# EasyEDA Pro project TempControl_PSU.eprj

# Schematic PSU
Create Date: 2024-05-29; Page Name: ILX Lightwave LDT-5910 Replacement PSU; Project Name: TempControl_PSU; Schematic Name: PSU; Update Date: 2024-05-29; Company: EasyEDA.com; Drawn: EasyEDA; Page Size: A4; Part Number: JLCPCB-002; Reviewed: EasyEDA; Version: V0.1
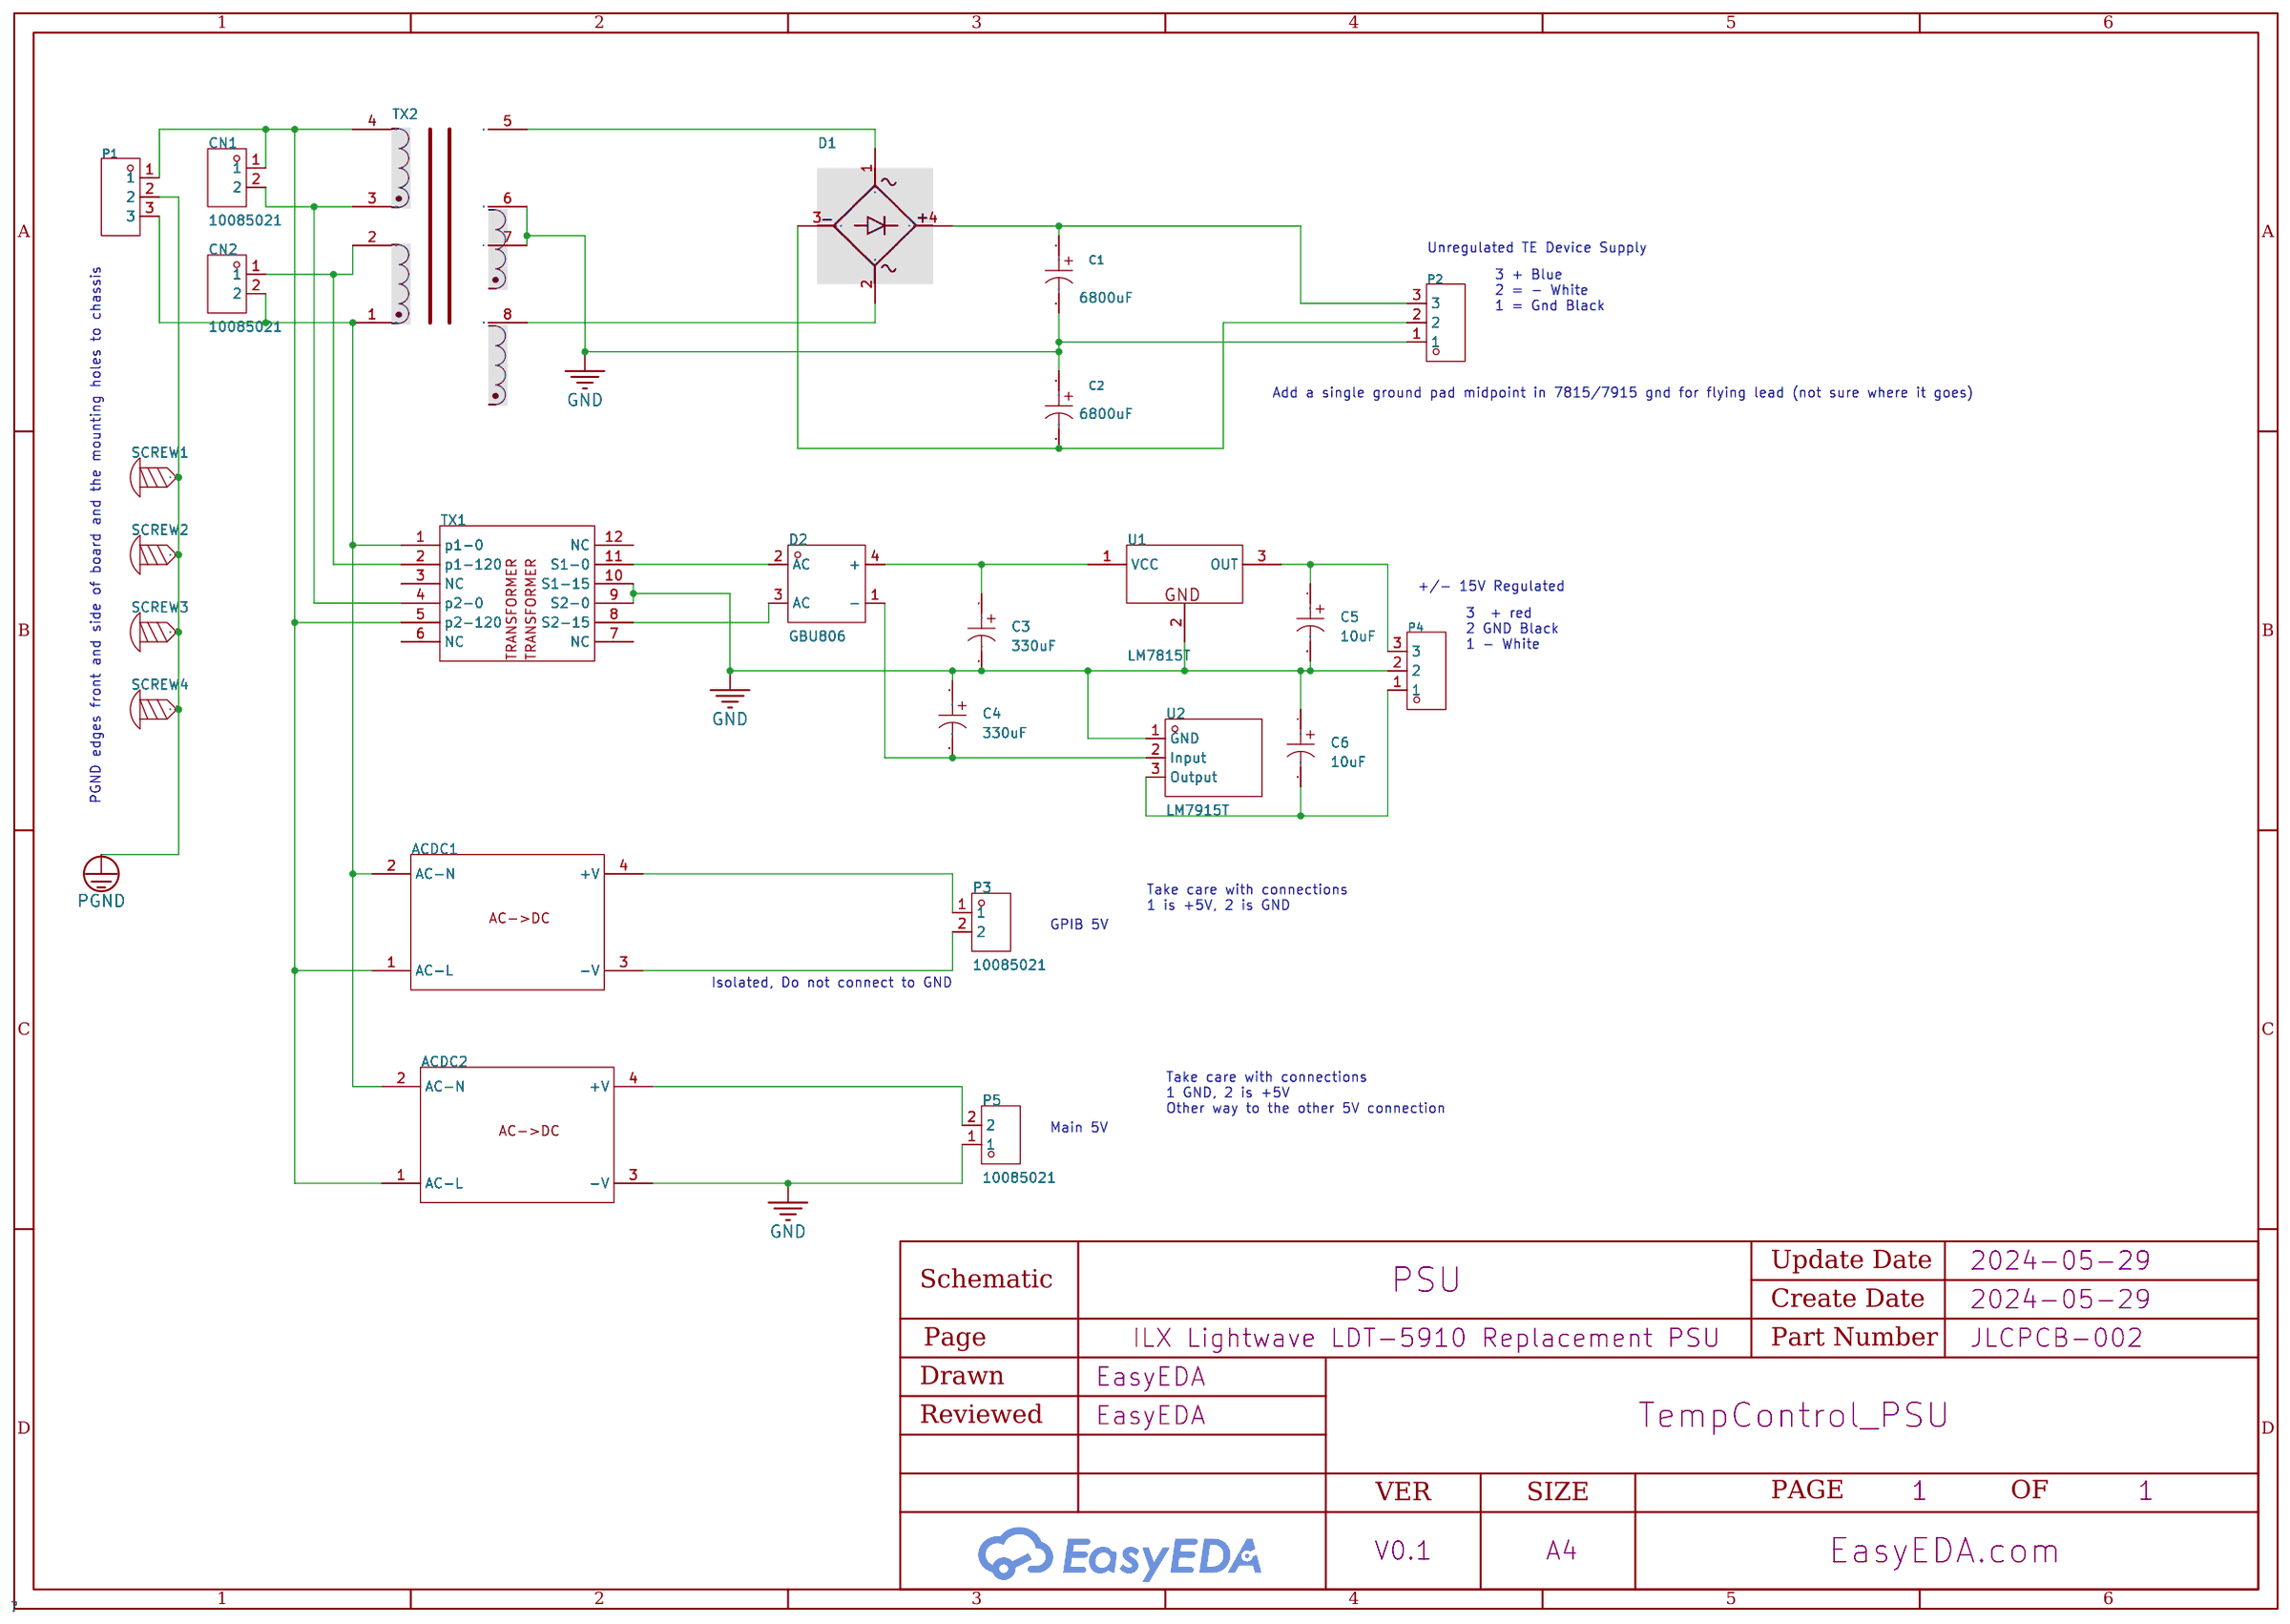
[diagram p0: schematic sheet]

## Parts
ACDC1  -  [IRM-05_ACDC_COnverter]
ACDC2  -  [IRM-05_ACDC_COnverter]
C1  6800uF  [CAP-TH_BD25.0-P12.00-D1.4-FD]
C2  6800uF  [CAP-TH_BD25.0-P12.00-D1.4-FD]
C3  330uF  [CAP-TH_BD13.0-P5.00-D1.2-FD]
C4  330uF  [CAP-TH_BD13.0-P5.00-D1.2-FD]
C5  10uF  [CAP-TH_BD5.0-P2.00-D0.5-FD-1]
C6  10uF  [CAP-TH_BD5.0-P2.00-D0.5-FD-1]
CN1  10085021  [CONN-TH_P5.08_10085021]
CN2  10085021  [CONN-TH_P5.08_10085021]
D1  -  [10.8_x 8.2 Square_4-4-Pin]
D2  GBU806  [GBU_4P-L22.0-W3.5-P5.08]
P1  HX CH3.96-3P ZZ  [CONN-TH_3P-P3.96_HX-CH3.96-3P-ZZ]
P2  HX CH3.96-3P ZZ  [CONN-TH_3P-P3.96_HX-CH3.96-3P-ZZ]
P3  10085021  [CONN-TH_P5.08_10085021]
P4  HX CH3.96-3P ZZ  [CONN-TH_3P-P3.96_HX-CH3.96-3P-ZZ]
P5  10085021  [CONN-TH_P5.08_10085021]
SCREW1  -  [Screw-Hole-M2]
SCREW2  -  [Screw-Hole-M2]
SCREW3  -  [Screw-Hole-M2]
SCREW4  -  [Screw-Hole-M2]
TX1  -  [EMT474-Transformer]
TX2  -  [LP-12-3800 ]
U1  LM7815T  [TO-220-3_L10.0-W4.5-P2.54-L]
U2  LM7915T  [TO-220-3_L10.2-W4.5-P2.54-L]

## Library data of the parts
ACDC1 ACDC2 = IRM-05: AC DC Converter
C1 C2 = UVR1H682MRD6: Capacitance: Tolerance:±20% Tolerance:±20% Rated Voltage: Ripple Current:3.3A@120Hz Equivalent Series Resistance(ESR):- Lead Spacing:12.5mm φD: L: Lifetime @ Temp:2000hrs@85℃ Operating Temperature:-40℃~+85℃ Operating Temperature:-40℃~+85℃; LCSC Part Name: 6800uF ±20% 50V; Supplier Part: C1579552; Manufacturer: Nichicon(尼吉康); Supplier Footprint: 插件,D25xL40mm; JLCPCB Part Class: Extended Part; Datasheet: https://atta.szlcsc.com/upload/public/pdf/source/20220407/953DDCD01B9E97562601DAF22397FCE9.pdf; Supplier: LCSC; Tolerance: ±20%; Ripple Current: 3.3A@120Hz; Lead Spacing: 12.5mm; Lifetime @ Temp: 2000hrs@85℃; Operating Temperature: -40℃~+85℃
C3 C4 = 63V330uF CD288: Capacitance: Tolerance:±20% Tolerance:±20% Rated Voltage: Lead Spacing: φD: L: Operating Temperature:-40℃~+105℃ Operating Temperature:-40℃~+105℃; LCSC Part Name: 330uF ±20% 63V; Supplier Part: C2960417; Manufacturer: HRK(鸿瑞凯电子); Supplier Footprint: 插件,D13xL20mm; JLCPCB Part Class: Extended Part; Datasheet: https://atta.szlcsc.com/upload/public/pdf/source/20220224/53DC5B1E5A41178451A8A0FCD5F50EDC.pdf; Supplier: LCSC; Tolerance: ±20%; Operating Temperature: -40℃~+105℃
C5 C6 = UPW1H100MDD1TD: Capacitance: Tolerance:±20% Tolerance:±20% Rated Voltage: Equivalent Series Resistance(ESR):- Lead Spacing: φD: Lifetime @ Temp:2000hrs@105℃ Operating Temperature:-55℃~+105℃ Operating Temperature:-55℃~+105℃; LCSC Part Name: 10uF ±20% 50V; Supplier Part: C1579785; Manufacturer: Nichicon(尼吉康); Supplier Footprint: 插件; JLCPCB Part Class: Extended Part; Datasheet: https://atta.szlcsc.com/upload/public/pdf/source/20211025/EECBE34A89216F51F627A84DEC6D5423.pdf; Supplier: LCSC; Tolerance: ±20%; Lifetime @ Temp: 2000hrs@105℃; Operating Temperature: -55℃~+105℃
CN1 CN2 P3 P5 = 10085021: Pins Structure:1x2P Pitch:5.08mm Mounting Style:Straight Reference Series:- Number of Pins:2P Number of Rows:1 Number of PINs Per Row:2 Row Spacing:- Current Rating (Max):- Operating Temperature Range:- Operating Temperature Range:-; LCSC Part Name: 1x2P 间距:5.08mm 直插; Supplier Part: C585760; Manufacturer: MOLEX; Supplier Footprint: 插件,P=5.08mm; JLCPCB Part Class: Extended Part; Datasheet: https://atta.szlcsc.com/upload/public/pdf/source/20200622/C585760_83E195231CF45E3DF0E141052E42BC2E.pdf; Supplier: LCSC; Pins Structure: 1x2P; Pitch: 5.08mm; Mounting Style: Straight; Number of Pins: 2P; Number of Rows: 1; Number of PINs Per Row: 2
D1 = MB805_Bridge_Rectifier
D2 = GBU806: Forward Voltage (Vf@If):1.1V@8A Reverse Voltage (Vr): Average Rectified Current (Io): Reverse Leakage Current (Ir):5uA@600V Peak Forward Surge Current: Operating Temperature:-55℃~+150℃@(Tj) Operating Temperature:-55℃~+150℃@(Tj); LCSC Part Name: 电压:600V 电流:8A; Supplier Part: C2440245; Manufacturer: DIYI(迪一/芯诺); Supplier Footprint: GBU; JLCPCB Part Class: Extended Part; Datasheet: https://atta.szlcsc.com/upload/public/pdf/source/20201225/C2440245_4680A65AAAD06D8CDC2A84171745141D.pdf; Supplier: LCSC; Forward Voltage (Vf@If): 1.1V@8A; Reverse Leakage Current (Ir): 5uA@600V; Operating Temperature: -55℃~+150℃@(Tj)
P1 P2 P4 = HX CH3.96-3P ZZ: Pins Structure:1x3P Pitch:3.96mm Mounting Style:Straight Reference Series:CH Number of Pins:3P Number of Rows:1 Number of PINs Per Row:3 Current Rating (Max):7A Contact Material:锡青磷铜 Operating Temperature Range:-25℃~+85℃ Operating Temperature Range:-25℃~+; LCSC Part Name: 1x3P 间距:3.96mm 直插 系列:CH; Supplier Part: C19189062; Manufacturer: hanxia(韩下); Supplier Footprint: 插件,P=3.96mm; Datasheet: https://atta.szlcsc.com/upload/public/pdf/source/20231103/5C27B7E48A45718DD3D3E2C65BD0FBEB.pdf; Supplier: LCSC; Pins Structure: 1x3P; Pitch: 3.96mm; Mounting Style: Straight; Reference Series: CH; Number of Pins: 3P; Number of Rows: 1; Number of PINs Per Row: 3; Current Rating (Max): 7A; Contact Material: 锡青磷铜; Operating Temperature Range: -25℃~+85℃
SCREW1-SCREW4 = Screw-Hole-M2: Supplier Footprint: 插件
TX1 = Transformer 2x15V
TX2 = LP-12-3800 Transformer
U1 = LM7815T: Output Type:-; LCSC Part Name: 固定电压稳压器; Supplier Part: C507139; Manufacturer: HGSEMI(华冠); Supplier Footprint: TO-220; JLCPCB Part Class: Extended Part; Datasheet: https://atta.szlcsc.com/upload/public/pdf/source/20200408/C507146_5EC04067C7C36E65EBB4C17815E2E420.pdf; Supplier: LCSC
U2 = LM7915T: Output Voltage:15V Output Voltage:15V; Supplier Part: C2926296; Manufacturer: HGSEMI(华冠); Supplier Footprint: TO-220; JLCPCB Part Class: Extended Part; Datasheet: https://atta.szlcsc.com/upload/public/pdf/source/20220921/D54579C407B8098A57F5285C42DC4416.pdf; Supplier: LCSC; Output Voltage: 15V

## Nets
GND: ACDC2.3(-V) C1.2 C2.1 C3.2 C4.1 C5.2 C6.1 P2.1 P4.2 P5.1 TX1.9(S2-0) TX1.10(S1-15) TX2.6 TX2.7 U1.2(GND) U2.1(GND)
PGND: P1.2 SCREW1.1 SCREW2.1 SCREW3.1 SCREW4.1
$1N416: D1.1 TX2.5
$1N420: D1.2 TX2.8
$1N1013: CN2.1 TX1.2(p1-120) TX2.2
$1N1031: CN1.2 TX1.4(p2-0) TX2.3
$1N1238: C2.2 D1.3 P2.2
$1N1245: C1.1 D1.4 P2.3
$1N1454: D2.2(AC) TX1.11(S1-0)
$1N1459: D2.3(AC) TX1.8(S2-15)
$1N1591: C3.1 D2.4(+) U1.1(VCC)
$1N1596: C4.2 D2.1(-) U2.2(Input)
$1N1847: C5.1 P4.3 U1.3(OUT)
$1N1858: C6.2 P4.1 U2.3(Output)
$1N2006: ACDC1.2(AC-N) ACDC2.2(AC-N) CN2.2 P1.3 TX1.1(p1-0) TX2.1
$1N2029: ACDC1.1(AC-L) ACDC2.1(AC-L) CN1.1 P1.1 TX1.5(p2-120) TX2.4
$1N2126: ACDC2.4(+V) P5.2
$1N2130: ACDC1.3(-V) P3.2
$1N2134: ACDC1.4(+V) P3.1

Not connected (* = marked no-connect by the designer): TX1 3(NC) 6(NC) 7(NC) 12(NC)

## Notes on the sheet
- Unregulated TE Device Supply
- 3 + Blue
  2 = - White
  1 = Gnd Black
- Add a single ground pad midpoint in 7815/7915 gnd for flying lead (not sure where it goes)
- +/- 15V Regulated
- 3  + red
  2 GND Black
  1 - White
- PGND edges front and side of board and the mounting holes to chassis
- Take care with connections
  1 is +5V, 2 is GND
- GPIB 5V
- Isolated, Do not connect to GND
- Take care with connections
  1 GND, 2 is +5V
  Other way to the other 5V connection
- Main 5V

# Board PCB1
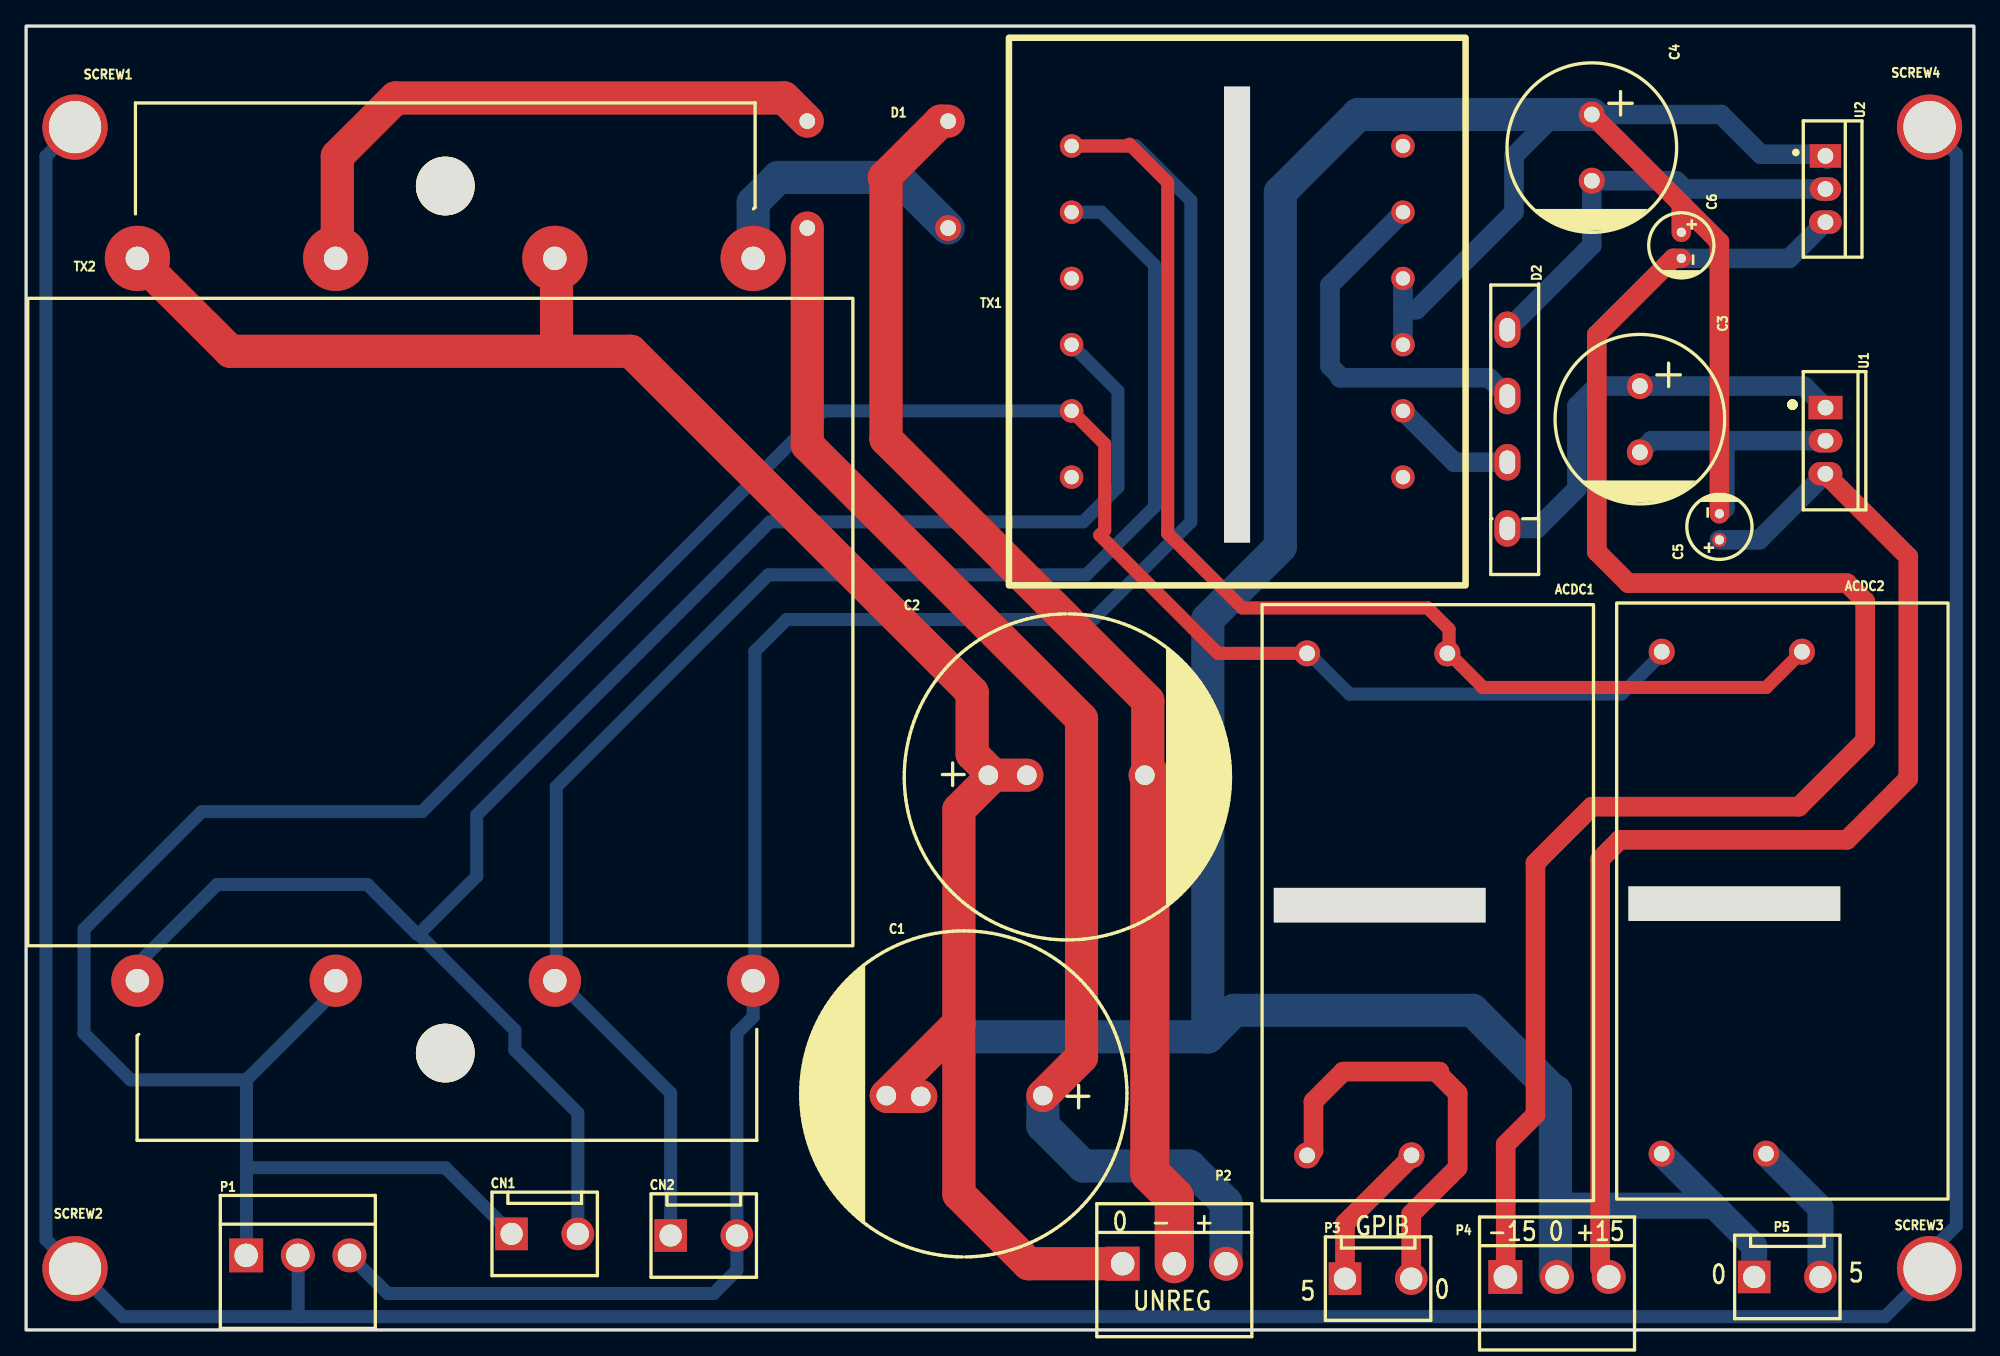
[diagram p1: board, top side]
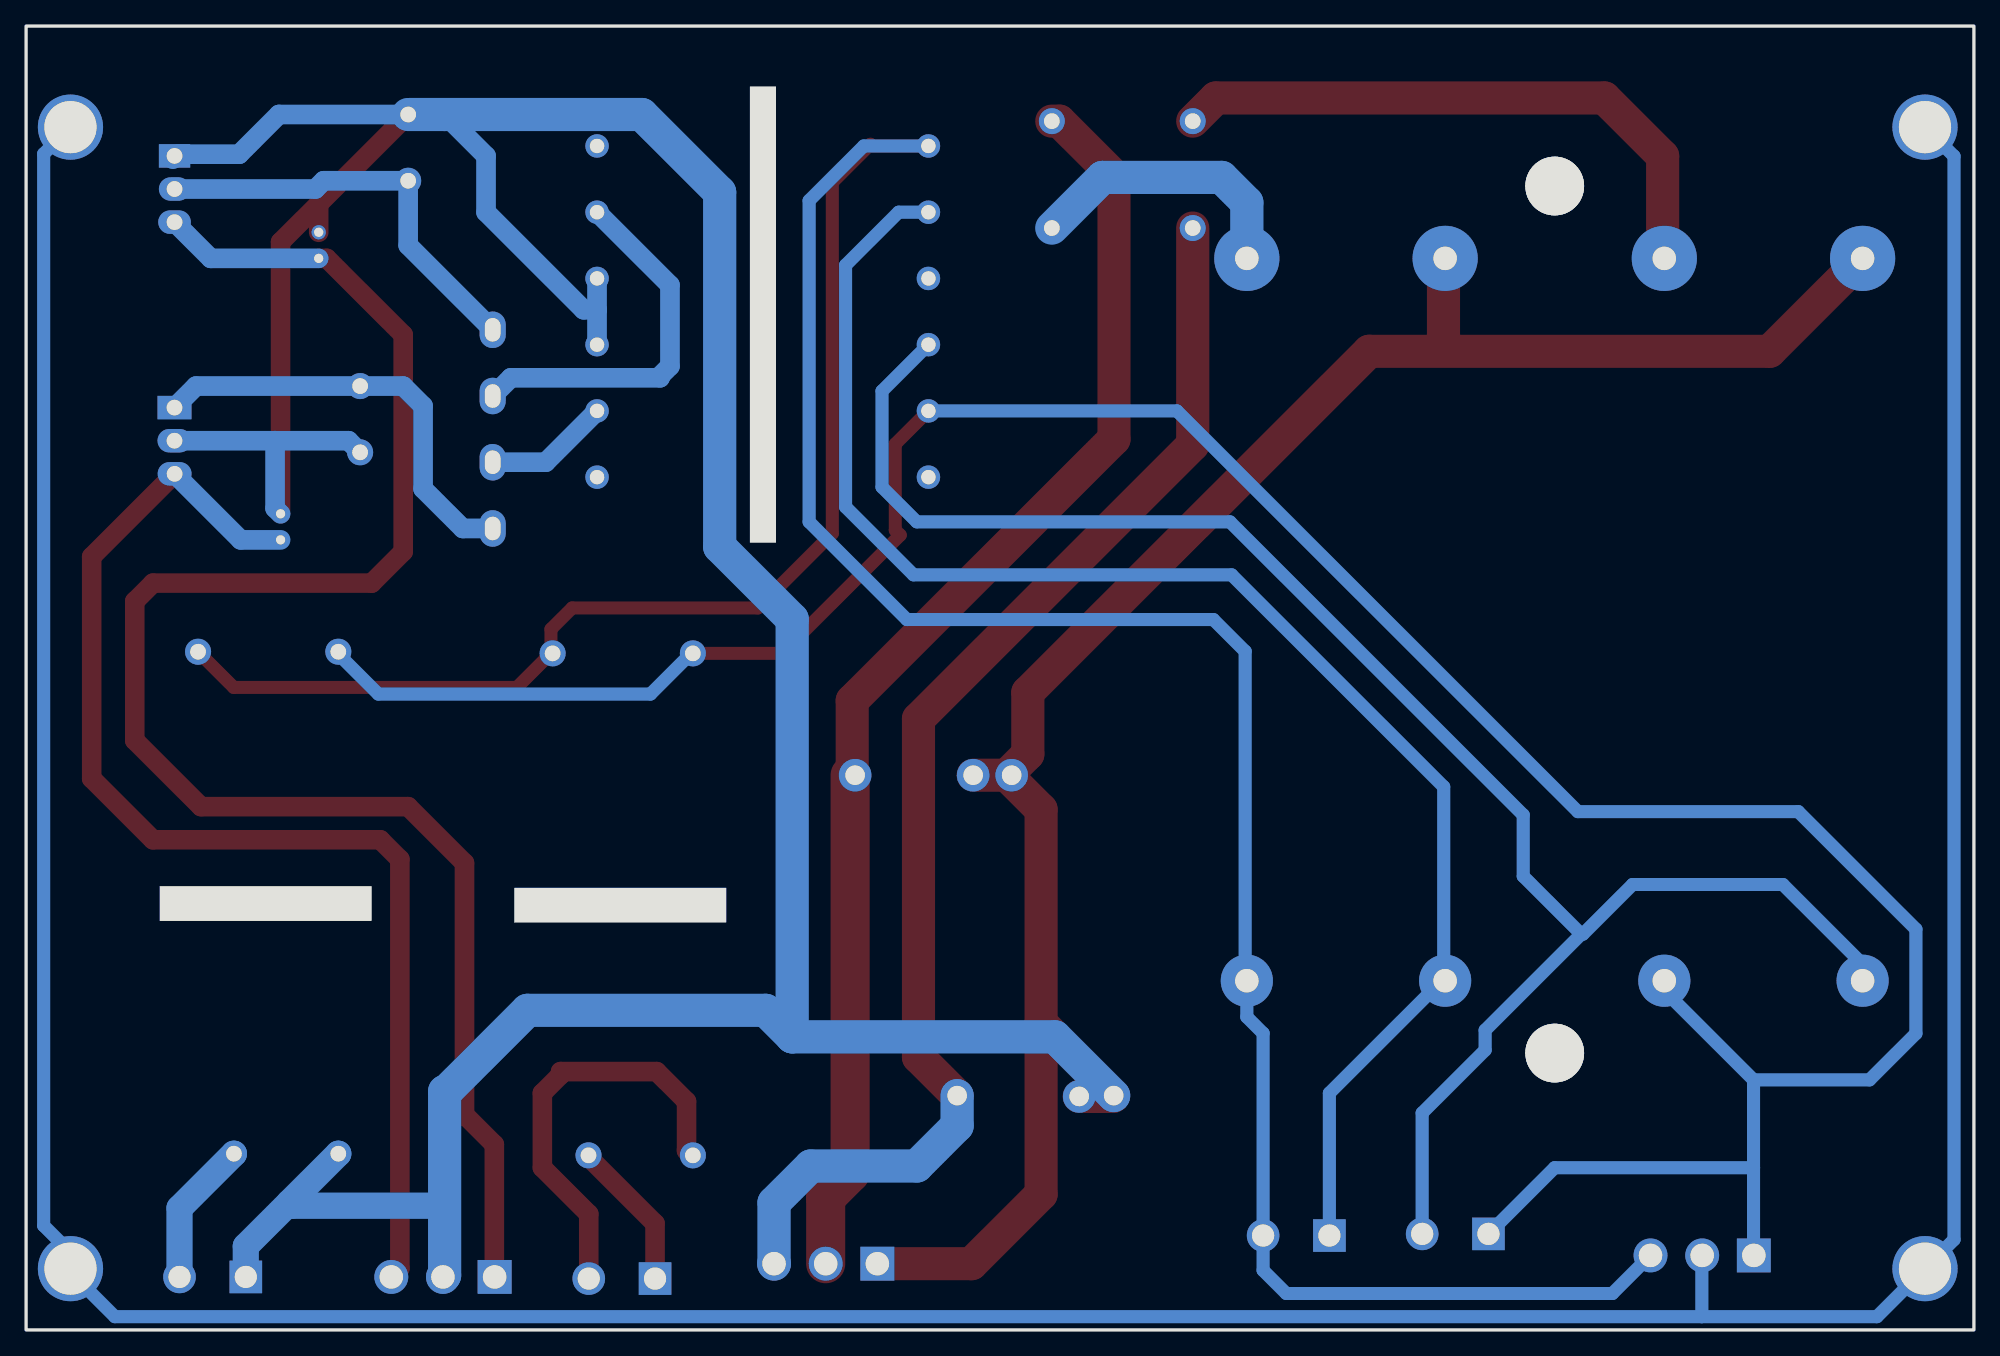
[diagram p2: board, bottom side, seen from below]

Outline 149.3 x 100 mm; copper layers: Top Layer, Bottom Layer. Coordinates in mm from the lower left corner of the outline.
Outline path: rectangle 0,100 149.3,0
Stack: Top Layer 0.035mm / Dielectric1 1.51mm FR4 er 4.5 / Bottom Layer 0.035mm

## Design rules (mm)
template: Custom Config
spacing copperThickness1oz (default): track to track 0.102, other pairs 0.152 to 0.3
spacing copperThickness2oz: track to track 0.203, other pairs 0.152 to 0.3
track width copperThickness1oz (default): min 0.127, default 0.254, max 3
track width copperThickness2oz: min 0.203, default 0.254, max 2.54
differential pair differentialPair (default): width min 0.127, default 0.254, max 2.54; gap min 0.152, default 0.152
via viaSize (default): diameter min 0.5, default 0.61, max 10; hole min 0.3, default 0.305, max 6.3

## Placement (name value [footprint] x y rotation side)
ACDC1  -  [IRM-05_ACDC_COnverter]  94.74 32.64 270 top
ACDC2  -  [IRM-05_ACDC_COnverter]  121.92 32.77 270 top
C1  6800uF  [cap-th_bd25.0-p12.00-d1.4-fd]  71.94 17.97 180 top
C2  6800uF  [cap-th_bd25.0-p12.00-d1.4-fd]  79.76 42.55 0 top
C3  330uF  [CAP-TH_BD13.0-P5.00-D1.2-FD]  123.7 69.85 270 top
C4  330uF  [CAP-TH_BD13.0-P5.00-D1.2-FD]  120.01 90.68 270 top
C5  10uF  [CAP-TH_BD5.0-P2.00-D0.5-FD-1]  129.79 61.59 90 top
C6  10uF  [CAP-TH_BD5.0-P2.00-D0.5-FD-1]  126.87 83.19 270 top
CN1  10085021  [CONN-TH_P5.08_10085021]  39.75 7.37 0 top
CN2  10085021  [CONN-TH_P5.08_10085021]  51.94 7.24 0 top
D1  -  [10.8_x 8.2 Square_4-4-Pin]  65.28 92.71 180 top
D2  GBU806  [GBU_4P-L22.0-W3.5-P5.08]  113.54 69.09 270 top
NOREF  -  [Pad_e39]  76.71 42.55 270 top
NOREF#2  -  [Pad_e26]  68.58 17.91 270 top
P1  HX CH3.96-3P ZZ  [CONN-TH_3P-P3.96_HX-CH3.96-3P-ZZ]  20.83 5.72 0 top
P2  HX CH3.96-3P ZZ  [CONN-TH_3P-P3.96_HX-CH3.96-3P-ZZ]  88.01 5.08 0 top
P3  10085021  [CONN-TH_P5.08_10085021]  103.63 3.94 0 top
P4  HX CH3.96-3P ZZ  [CONN-TH_3P-P3.96_HX-CH3.96-3P-ZZ]  117.35 4.06 0 top
P5  10085021  [CONN-TH_P5.08_10085021]  135 4.06 0 top
SCREW1  -  [screw-hole-m2]  3.75 92.25 0 top
SCREW2  -  [screw-hole-m2]  3.75 4.7 0 top
SCREW3  -  [screw-hole-m2]  145.9 4.7 0 top
SCREW4  -  [screw-hole-m2]  145.9 92.25 0 top
TX1  -  [EMT474-Transformer]  92.84 78.11 0 top
TX2  -  [lp-12-3800 ]  32.13 54.48 0 top
U1  LM7815T  [TO-220-3_L10.0-W4.5-P2.54-L]  137.92 68.2 270 top
U2  LM7915T  [to-220-3_l10.2-w4.5-p2.54-l]  137.92 87.5 270 top

## Footprints (pads in the part's own frame, mm; a bottom-side part is the same pattern mirrored in y, then rotated)
10.8_x 8.2 Square_4-4-Pin
  round 2 hole 1.2: 1(-5.4,8.2) 2(5.4,0) 3(-5.4,0) 4(5.4,8.2)
CAP-TH_BD5.0-P2.00-D0.5-FD-1
  round 1.1 hole 0.7: 1(-1,0) 2(1,0)
CAP-TH_BD13.0-P5.00-D1.2-FD
  round 2 hole 1.2: 1(-2.54,0) 2(2.54,0)
cap-th_bd25.0-p12.00-d1.4-fd
  round 2.5 hole 1.5: 1(-6,0) 2(6,0)
CONN-TH_3P-P3.96_HX-CH3.96-3P-ZZ
  rect 2.6x2.6 hole 1.8: 1(-3.96,0)
  round 2.6 hole 1.8: 2(0,0) 3(3.96,0)
CONN-TH_P5.08_10085021
  rect 2.5x2.5 hole 1.7: 1(-2.54,0)
  round 2.5 hole 1.7: 2(2.54,0)
EMT474-Transformer
  round 1.8 hole 1.1: 1(-12.7,12.7) 2(-12.7,7.62) 3(-12.7,2.54) 4(-12.7,-2.54) 5(-12.7,-7.62) 6(-12.7,-12.7) 7(12.7,-12.7) 8(12.7,-7.62) 9(12.7,-2.54) 10(12.7,2.54) 11(12.7,7.62) 12(12.7,12.7)
GBU_4P-L22.0-W3.5-P5.08
  oval 2.8x2 hole 1.8x1.2: 1(-7.62,0) 2(-2.54,0) 3(2.54,0) 4(7.62,0)
IRM-05_ACDC_COnverter
  round 2 hole 1.2: 1(-19.25,3.45) 2(-19.25,14.2) 3(19.25,3.45) 4(19.25,11.45)
lp-12-3800 
  round 4 hole 1.8: 1(23.6,-27.7) 2(8.4,-27.7) 3(-23.6,-27.7) 4(-8.4,-27.7)
  round 5 hole 1.8: 5(23.6,27.7) 6(8.4,27.7) 7(-23.6,27.7) 8(-8.4,27.7)
  round 4.5 hole 4.5: HOLE1(0,33.25) HOLE2(0,-33.25)
Pad_e26
  round 2.5 hole 1.5: 13(0,0)
Pad_e39
  round 2.5 hole 1.5: 14(0,0)
screw-hole-m2
  round 5 hole 4: 1(0,0)
TO-220-3_L10.0-W4.5-P2.54-L
  rect 1.8x2.6 hole 1.2: 1(-2.54,0.005)
  oval 1.8x2.6 hole 1.2: 2(0,0.005) 3(2.54,-0.005)
to-220-3_l10.2-w4.5-p2.54-l
  rect 1.8x2.4 hole 1.2: 1(-2.54,0)
  oval 1.8x2.4 hole 1.2: 2(0,0)
  oval 1.8x2.5 hole 1.2: 3(2.54,0)

## Nets
As in the schematic, except:
GND: ACDC2.3 C1.2 C2.1 C3.2 C4.1 C5.2 C6.1 NOREF.14 NOREF#2.13 P2.1 P4.2 P5.1 TX1.9 TX1.10 TX2.6 TX2.7 U1.2 U2.1

Pads without a net: TX1 3 6 7 12; TX2 HOLE1 HOLE2

## Routing (per net, layer and track width the routed paths; a pad name or vN(x,y) marks a point on that pad's centre or on a via; arc(x,y) is an arc through that point)
GND: length 448.7
  Top Layer w1.5: C4.1 126.87,86.36 ; 126.87,86.36 C6.1 ; 126.87,86.36 129.79,83.44 C5.2
  Top Layer w2.54: 40.66,75.56 40.66,82.06 TX2.6 ; 74.14,42.55 72.52,44.17 72.52,48.89 46.36,75.06 15.66,75.06 TX2.7 ; 74.14,42.55 71.5,39.91 71.5,23.54 ; 74.14,42.55 NOREF.14 ; 71.5,23.54 C1.2 66,17.91 NOREF#2.13 ; 71.5,23.54 71.5,10.41 76.84,5.08 P2.1
  Bottom Layer w1.5: 130.22,68.2 130.22,63.02 C5.2 ; 130.22,68.2 U1.2 ; 130.22,68.2 124.59,68.2 C3.2 ; 105.54,78.25 106.57,78.25 114.05,85.72 114.05,90.04 117.22,93.22 ; 105.54,78.25 TX1.9 ; 105.54,78.25 105.54,80.64 ; 138.05,89.79 137.67,90.17 132.97,90.17 129.92,93.22 C4.1
  Bottom Layer w2: P4.2 117.35,9.53 128.87,9.53 129.11,9.77 ; ACDC2.3 129.11,9.77 ; 129.11,9.77 132.46,6.43 P5.1
  Bottom Layer w2.54: C4.1 102.11,93.22 96.14,87.25 96.14,60.07 90.58,54.51 90.58,22.48 ; 90.58,22.48 92.61,24.51 110.87,24.51 117.09,18.29 117.22,18.29 117.22,4.19 P4.2 ; 90.58,22.48 70.44,22.48 C1.2
PGND: length 328.7
  Bottom Layer w1: 20.86,1.02 20.86,5.69 P1.2 ; 20.86,1.02 142.49,1.02 145.9,4.42 SCREW3.1 145.9,5.95 147.96,8 147.96,90.19 SCREW4.1 ; 20.86,1.02 7.43,1.02 SCREW2.1 1.52,6.93 1.52,90.02 SCREW1.1
$1N416: length 21.6
  Bottom Layer w2.54: D1.1 66.8,88.39 57.66,88.39 55.73,86.47 TX2.5
$1N420: length 45.1
  Top Layer w2.54: 23.86,83.58 23.86,90.03 28.32,94.49 58.1,94.49 D1.2
$1N1013: length 119.4
  Bottom Layer w1: 80.14,85.72 82.42,85.72 86.49,81.66 86.49,63.12 81.28,57.91 56.9,57.91 40.64,41.66 40.64,26.92 49.4,18.16 49.4,7.24
$1N1031: length 136.5
  Bottom Layer w1: 8.66,28.18 14.64,34.16 26.16,34.16 29.97,30.35 30.1,30.35 ; CN1.2 42.29,16.64 37.47,21.46 37.47,22.99 30.1,30.35 ; 30.1,30.35 34.54,34.8 34.54,39.5 57.02,61.98 81.03,61.98 83.69,64.64 83.69,72.01 TX1.4
$1N1238: length 99.2
  Top Layer w2.54: 86.14,42.55 85.98,42.7 85.98,48.26 65.91,68.33 65.91,88.27 65.79,88.39 70.1,92.71 D1.3
  Top Layer w3: 86.14,42.55 86.14,12.03 88.01,10.16 P2.2
$1N1245: length 99.9
  Top Layer w2.54: C1.1 80.9,20.93 80.9,46.86 59.88,67.88 D1.4
  Bottom Layer w2.54: P2.3 91.97,9.76 89.15,12.57 81.03,12.57 77.94,15.66 C1.1
$1N1454: length 28.7
  Bottom Layer w1.5: D2.2 112.14,73.03 100.71,73.03 100.71,73.15 99.95,73.91 99.95,80.14 105.54,85.72
$1N1459: length 9.6
  Bottom Layer w1.5: TX1.8 109.47,66.55 D2.3
$1N1591: length 33.3
  Bottom Layer w1.5: D2.4 115.82,61.47 118.87,64.52 118.87,70.87 120.4,72.39 C3.1 136.28,72.39 U1.1
$1N1596: length 32.3
  Bottom Layer w1.5: U2.2 127.13,87.5 126.49,88.14 C4.2 120.01,83.19 D2.1
$1N1847: length 94.7
  Top Layer w1.5: P4.3 120.65,4.72 120.65,36.09 122.15,37.59 139.57,37.59 144.27,42.29 144.27,59.3 137.92,65.66
  Bottom Layer w1.5: 137.92,65.66 132.85,60.59 C5.1
$1N1858: length 132.4
  Top Layer w1.5: C6.2 126.25,82.19 120.4,76.33 120.4,59.69 122.81,57.28 139.57,57.28 140.97,55.88 140.97,45.21 135.89,40.13 120.01,40.13 115.7,35.81 115.7,16.51 113.41,14.22 113.41,4.09 P4.1
  Bottom Layer w1.5: C6.2 135.14,82.19 U2.3
$1N2006: length 244.1
  Top Layer w1: TX1.1 84.46,90.81 84.58,90.93 87.5,88.01 87.5,61.09 93.22,55.37 107.44,55.37 109.07,53.75 109.07,51.89 111.63,49.33 111.63,49.28 133.38,49.28 ACDC2.2
  Bottom Layer w1: TX1.1 85.09,90.81 89.28,86.61 89.28,61.98 81.79,54.48 58.29,54.48 55.86,52.05 55.86,28.18 55.73,28.05 TX2.1 55.73,24 54.48,22.75 CN2.2 54.48,4.57 52.7,2.79 27.71,2.79 P1.3
$1N2029: length 220.9
  Top Layer w1: 98.32,51.89 91.37,51.89 82.3,60.96 82.68,61.34 82.68,67.94 TX1.5
  Bottom Layer w1: 16.89,19.18 23.86,26.14 23.86,26.53 23.6,26.78 ; 16.89,19.18 16.89,12.44 ; 16.89,19.18 8,19.18 4.44,22.73 4.44,30.73 13.46,39.75 30.35,39.75 61.09,70.48 TX1.5 ; 16.89,12.44 32.14,12.44 CN1.1 ; 16.89,12.44 16.89,5.74 P1.1 ; 98.32,51.89 101.44,48.77 122.3,48.77 125.37,51.84 ACDC2.1
$1N2126: length 11.2
  Bottom Layer w2: ACDC2.4 137.54,9.34 P5.2
$1N2130: length 32.8
  Top Layer w1.5: 98.32,13.39 98.68,13.75 98.68,17.53 100.97,19.81 108.33,19.81 108.33,19.56 109.73,18.16 109.73,12.45 106.17,8.89 P3.2
$1N2134: length 11.6
  Top Layer w1.5: P3.1 101.09,8.16 106.32,13.39

## Text on the board
Top Silkscreen Layer: 0  -  + | UNREG | 5 | GPIB | 0 | -15 0 +15
